# EAGLE design Arduino_PLC (EAGLE 9.6.2)
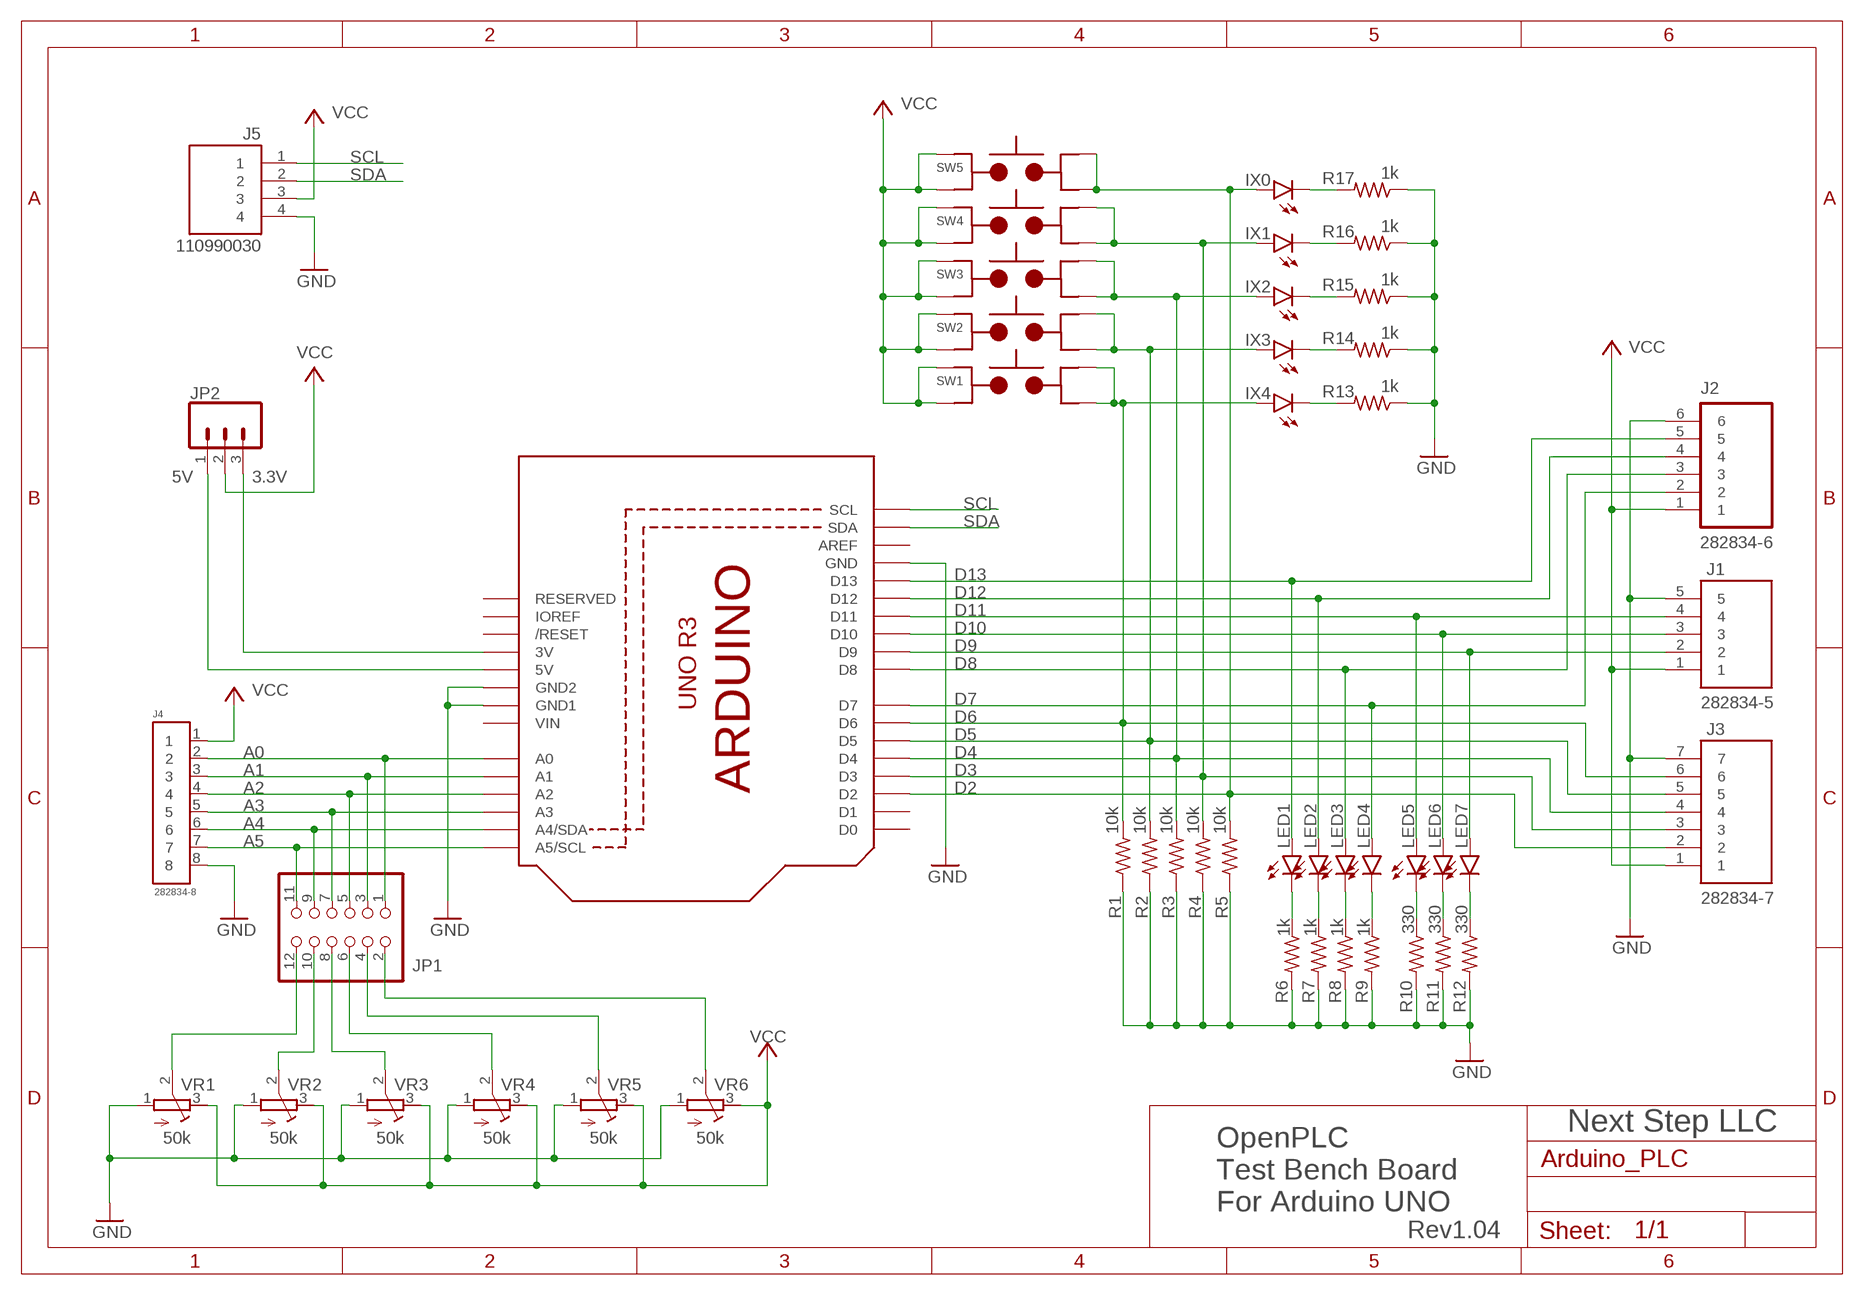
[diagram p0: schematic, sheet 1]

## Parts
IX0  LEDCHIP-LED0603  [CHIP-LED0603]
IX1  LEDCHIP-LED0603  [CHIP-LED0603]
IX2  LEDCHIP-LED0603  [CHIP-LED0603]
IX3  LEDCHIP-LED0603  [CHIP-LED0603]
IX4  LEDCHIP-LED0603  [CHIP-LED0603]
J1  282834-5  [TE_282834-5]
J2  282834-6  [TE_282834-6]
J3  282834-7  [TE_282834-7]
J4  282834-8  [HDRV8W85P254_8X1_2078X650X1000]
J5  110990030  [SEEED_110990030]
JP1  PINHD-2X6  [2X06]
JP2  455-1750-1-ND  CONN_03  [1X03]
LED1  LEDCHIP-LED0603  [CHIP-LED0603]
LED2  LEDCHIP-LED0603  [CHIP-LED0603]
LED3  LEDCHIP-LED0603  [CHIP-LED0603]
LED4  LEDCHIP-LED0603  [CHIP-LED0603]
LED5  LEDCHIP-LED0603  [CHIP-LED0603]
LED6  LEDCHIP-LED0603  [CHIP-LED0603]
LED7  LEDCHIP-LED0603  [CHIP-LED0603]
R1  10k  R-US_R0603  [R0603]
R2  10k  R-US_R0603  [R0603]
R3  10k  R-US_R0603  [R0603]
R4  10k  R-US_R0603  [R0603]
R5  10k  R-US_R0603  [R0603]
R6  1k  R-US_R0603  [R0603]
R7  1k  R-US_R0603  [R0603]
R8  1k  R-US_R0603  [R0603]
R9  1k  R-US_R0603  [R0603]
R10  330  R-US_R0603  [R0603]
R11  330  R-US_R0603  [R0603]
R12  330  R-US_R0603  [R0603]
R13  1k  R-US_R0603  [R0603]
R14  1k  R-US_R0603  [R0603]
R15  1k  R-US_R0603  [R0603]
R16  1k  R-US_R0603  [R0603]
R17  1k  R-US_R0603  [R0603]
SW1  TL3342F160QG/TR  [SW_TL3342F160QG/TR]
SW2  TL3342F160QG/TR  [SW_TL3342F160QG/TR]
SW3  TL3342F160QG/TR  [SW_TL3342F160QG/TR]
SW4  TL3342F160QG/TR  [SW_TL3342F160QG/TR]
SW5  TL3342F160QG/TR  [SW_TL3342F160QG/TR]
U1  ARDUINOR3-DIMENSION  [ARDUINOR3]
VR1  50k  R-TRIMM3339P  [RTRIM3339P]
VR2  50k  R-TRIMM3339P  [RTRIM3339P]
VR3  50k  R-TRIMM3339P  [RTRIM3339P]
VR4  50k  R-TRIMM3339P  [RTRIM3339P]
VR5  50k  R-TRIMM3339P  [RTRIM3339P]
VR6  50k  R-TRIMM3339P  [RTRIM3339P]

## Nets
A0: J4.2 JP1.1 U1.A0
A1: J4.3 JP1.3 U1.A1
A2: J4.4 JP1.5 U1.A2
A3: J4.5 JP1.7 U1.A3
A4: J4.6 JP1.9 U1.A4(A4/SDA)
A5: J4.7 JP1.11 U1.A5(A5/SCL)
D2: IX0.A J3.2 R5.2 SW5.1 SW5.2 U1.D2
D3: IX1.A J3.3 R4.2 SW4.1 SW4.2 U1.D3
D4: IX2.A J3.4 R3.2 SW3.1 SW3.2 U1.D4
D5: IX3.A J3.5 R2.2 SW2.1 SW2.2 U1.D5
D6: IX4.A J3.6 R1.2 SW1.1 SW1.2 U1.D6
D7: J2.2 LED4.A U1.D7
D8: J2.3 LED3.A U1.D8
D9: J1.2 LED7.A U1.D9
D10: J1.3 LED6.A U1.D10
D11: J1.4 LED5.A U1.D11
D12: J2.4 LED2.A U1.D12
D13: J2.5 LED1.A U1.D13
GND: J1.5 J2.6 J3.7 J4.8 J5.4 R1.1 R2.1 R3.1 R4.1 R5.1 R6.2 R7.2 R8.2 R9.2 R10.2 R11.2 R12.2 R13.1 R14.1 R15.1 R16.1 R17.1 U1.GND U1.GND1 U1.GND2 VR1.1(A) VR2.1(A) VR3.1(A) VR4.1(A) VR5.1(A) VR6.1(A)
N$1: LED1.C R6.1
N$2: LED2.C R7.1
N$3: LED3.C R8.1
N$4: LED4.C R9.1
N$5: LED5.C R10.1
N$6: LED6.C R11.1
N$7: LED7.C R12.1
N$8: JP1.12 VR1.2(S)
N$9: JP1.10 VR2.2(S)
N$10: JP1.8 VR3.2(S)
N$11: JP1.6 VR4.2(S)
N$12: JP1.4 VR5.2(S)
N$13: JP1.2 VR6.2(S)
N$14: JP2.3 U1.3V
N$16: JP2.1 U1.5V
N$17: IX0.C R17.2
N$18: IX1.C R16.2
N$19: IX2.C R15.2
N$20: IX3.C R14.2
N$21: IX4.C R13.2
SCL: J5.1 U1.SCL
SDA: J5.2 U1.SDA
VCC: J1.1 J2.1 J3.1 J4.1 J5.3 JP2.2 SW1.3 SW1.4 SW2.3 SW2.4 SW3.3 SW3.4 SW4.3 SW4.4 SW5.3 SW5.4 VR1.3(E) VR2.3(E) VR3.3(E) VR4.3(E) VR5.3(E) VR6.3(E)
Unconnected: U1.AREF U1.D0 U1.D1 U1.IOREF U1.RESERVED U1.RESET(/RESET)

## Notes on the sheet
- 5V | 3.3V
- Next Step LLC
- OpenPLC
  Test Bench Board
  For Arduino UNO
- Rev1.04

## Power pins joined to a net without a drawn wire
VIN: U1.VIN

## Library data of the parts
IX0 IX1-IX4 LED1-LED7 = led:LED: LED OSRAM: - CHIPLED LG R971, LG N971, LY N971, LG Q971, LY Q971, LO R971, LY R971 LH N974, LH R974 LS Q976, LO Q976, LY Q976 LO Q996 - Hyper CHIPLED LW Q18S LB Q993, LB Q99A, LB R99A - SideLED LS A670, LO A670, LY A670, LG A670, LP A670 LB A673, LV A673, LT A673, LW A673 LH A674 LY A675 LS A676, LA A676, LO A676, LY A676, LW A676 LS A679, LY A679, LG A679 - Hyper Micro SIDELED® LS Y876, LA Y876, LO Y876, LY Y876 LT Y87S - SmartLED LW L88C, LW L88S LB L89C, LB L89S, LG L890 LS L89K, LO L89K, LY L89K LS L896, LA L896, LO L896, LY L896 - TOPLED LS T670, LO T670, LY T670, LG T670, LP T670 LSG T670, LSP T670, LSY T670, LOP T670, LYG T670 LG T671, LOG T671, LSG T671 LB T673, LV T673, LT T673, LW T673 LH T674 LS T676, LA T676, LO T676, LY T676, LB T676, LH T676, LSB T676, LW T676 LB T67C, LV T67C, LT T67C, LS T67K, LO T67K, LY T67K, LW E67C LS E67B, LA E67B, LO E67B, LY E67B, LB E67C, LV E67C, LT E67C LW T67C LS T679, LY T679, LG T679 LS T770, LO T770, LY T770, LG T770, LP T770 LB T773, LV T773, LT T773, LW T773 LH T774 LS E675, LA E675, LY E675, LS T675 LS T776, LA T776, LO T776, LY T776, LB T776 LHGB T686 LT T68C, LB T68C - Hyper Mini TOPLED® LB M676 - Mini TOPLED Santana® LG M470 LS M47K, LO M47K, LY M47K Source: http://www.osram.convergy.de LUXEON: - LUMILED® LXK2-PW12-R00, LXK2-PW12-S00, LXK2-PW14-U00, LXK2-PW14-V00 LXK2-PM12-R00, LXK2-PM12-S00, LXK2-PM14-U00 LXK2-PE12-Q00, LXK2-PE12-R00, LXK2-PE12-S00, LXK2-PE14-T00, LXK2-PE14-U00 LXK2-PB12-K00, LXK2-PB12-L00, LXK2-PB12-M00, LXK2-PB14-N00, LXK2-PB14-P00, LXK2-PB14-Q00 LXK2-PR12-L00, LXK2-PR12-M00, LXK2-PR14-Q00, LXK2-PR14-R00 LXK2-PD12-Q00, LXK2-PD12-R00, LXK2-PD12-S00 LXK2-PH12-R00, LXK2-PH12-S00 LXK2-PL12-P00, LXK2-PL12-Q00, LXK2-PL12-R00 Source: www.luxeon.com KINGBRIGHT: KA-3528ASYC Source: www.kingbright.com
J1 = 282834-5:282834-5: Check availability <https://pricing.snapeda.com/parts/282834-5/TE%20Connectivity/view-part?ref=eda>; AVAILABILITY: In Stock; COMMENT: 282834-5; DESCRIPTION: Buchanan; Conn; Term Blk; PCB; 5; 2.54mm; Front; 30-16 AWG; Green; 10 A; 150 V; MF: TE Connectivity; MP: 282834-5; PACKAGE: None; PRICE: None; PURCHASE-URL: https://pricing.snapeda.com/search/part/282834-5/?ref=eda
J2 = 282834-6:282834-6: TERM BLOCK 6POS SIDE ENT 2.54MM Check availability <https://pricing.snapeda.com/parts/282834-6/TE%20Connectivity/view-part?ref=eda>; AVAILABILITY: In Stock; COMMENT: 282834-6; DESCRIPTION: Wire-To-Board Terminal Block, 6, 150 V, 10 A, 30 Awg, 16 Awg, 1.4 Mm; EU_ROHS_COMPLIANCE: Compliant with Exemptions; MF: TE Connectivity; MP: 282834-6; PACKAGE: None; PRICE: None; PURCHASE-URL: https://pricing.snapeda.com/search/part/282834-6/?ref=eda
J3 = 282834-7:282834-7: Check availability <https://pricing.snapeda.com/parts/282834-7/TE%20Connectivity/view-part?ref=eda>; AVAILABILITY: In Stock; COMMENT: 282834-7; DESCRIPTION: TERMI-BLOK PCB MOUNT, 90 7P.; EU_ROHS_COMPLIANCE: Compliant with Exemptions; MF: TE Connectivity; MP: 282834-7; PACKAGE: None; PRICE: None; PURCHASE-URL: https://pricing.snapeda.com/search/part/282834-7/?ref=eda
J4 = 282834-8:282834-8: Screw terminal 1.4 mm² Number of pins 8 282834-8 TE Connectivity Green 1 pc(s) Check availability <https://pricing.snapeda.com/parts/282834-8/TE%20Connectivity/view-part?ref=eda>; AVAILABILITY: In Stock; COMMENT: 282834-8; DESCRIPTION: Buchanan; Conn; Term Blk; PCB; 8; 2.54mm; Front; 30-16 AWG; Green; 10 A; 150 V; EU_ROHS_COMPLIANCE: Compliant with Exemptions; MF: TE Connectivity; MP: 282834-8; PACKAGE: None; PRICE: None; PURCHASE-URL: https://pricing.snapeda.com/search/part/282834-8/?ref=eda
J5 = 110990030:110990030: Check prices <https://pricing.snapeda.com/parts/110990030/Seeed%20Technology%20Co.%2C%20Ltd/view-part?ref=eda>; AVAILABILITY: Good; DESCRIPTION: GROVE 2MM 4PIN VERT CONN 10PCS; MF: Seeed Technology Co., Ltd; MP: 110990030; PACKAGE: None; PRICE: None; PURCHASE-URL: https://pricing.snapeda.com/search/part/110990030/?ref=eda
JP1 = pinhead:PINHD-2X6: PIN HEADER
JP2 = SparkFun-Connectors:CONN_03: Multi connection point. Often used as Generic Header-pin footprint for 0.1 inch spaced/style header connections On any of the 0.1 inch spaced packages, you can populate with these: Break Away Headers - Straight <https://www.sparkfun.com/products/116> (PRT-00116) Break Away Male Headers - Right Angle <https://www.sparkfun.com/products/553> (PRT-00553) Female Headers <https://www.sparkfun.com/products/115> (PRT-00115) Break Away Headers - Machine Pin <https://www.sparkfun.com/products/117> (PRT-00117) Break Away Female Headers - Swiss Machine Pin <https://www.sparkfun.com/products/743> (PRT-00743) Stackable Header - 3 Pin (Female, 0.1") <https://www.sparkfun.com/products/13875> (PRT-13875) For SCREWTERMINALS and SPRING TERMINALS visit here: Screw Terimnals on SparkFun.com <https://www.sparkfun.com/search/results?term=Screw+Terminals> (5mm/3.5mm/2.54mm spacing) This device is also useful as a general connection point to wire up your design to another part of your project. Our various solder wires solder well into these plated through hole pads. Hook-Up Wire - Assortment (Stranded, 22 AWG) <https://www.sparkfun.com/products/11375> (PRT-11375) Hook-Up Wire - Assortment (Solid Core, 22 AWG) <https://www.sparkfun.com/products/11367> (PRT-11367) View the entire wire category on our website here <https://www.sparkfun.com/categories/141> Special notes: Molex polarized connector foot print use with SKU : PRT-08232 with associated crimp pins and housings.; PROD_ID: XXX-00000
R1-R17 = rcl:R-US_: RESISTOR, American symbol; SPICEPREFIX: R
SW1-SW5 = TL3342F160QG_TR:TL3342F160QG/TR: TL3342 Series SPST 1.6 N Round Button Gull Wing Surface Mount Tactile Switch Check availability <https://pricing.snapeda.com/parts/TL3342F160QG/TR/E-Switch/view-part?ref=eda>; AVAILABILITY: In Stock; DESCRIPTION: Tactile Switch SPST-NO Top Actuated Surface Mount; MF: E-Switch; MP: TL3342F160QG/TR; PACKAGE: None; PRICE: None; PURCHASE-URL: https://pricing.snapeda.com/search/part/TL3342F160QG/TR/?ref=eda
U1 = adafruit:ARDUINOR3: This is a new object for the new Arduino R3 - with extra pins that you may want to use (such as IOref, and duplicated A4/A5
VR1-VR6 = rcl:R-TRIMM: Trimm resistor; SPICEMODEL: X; SPICEPREFIXL: POT

## Board
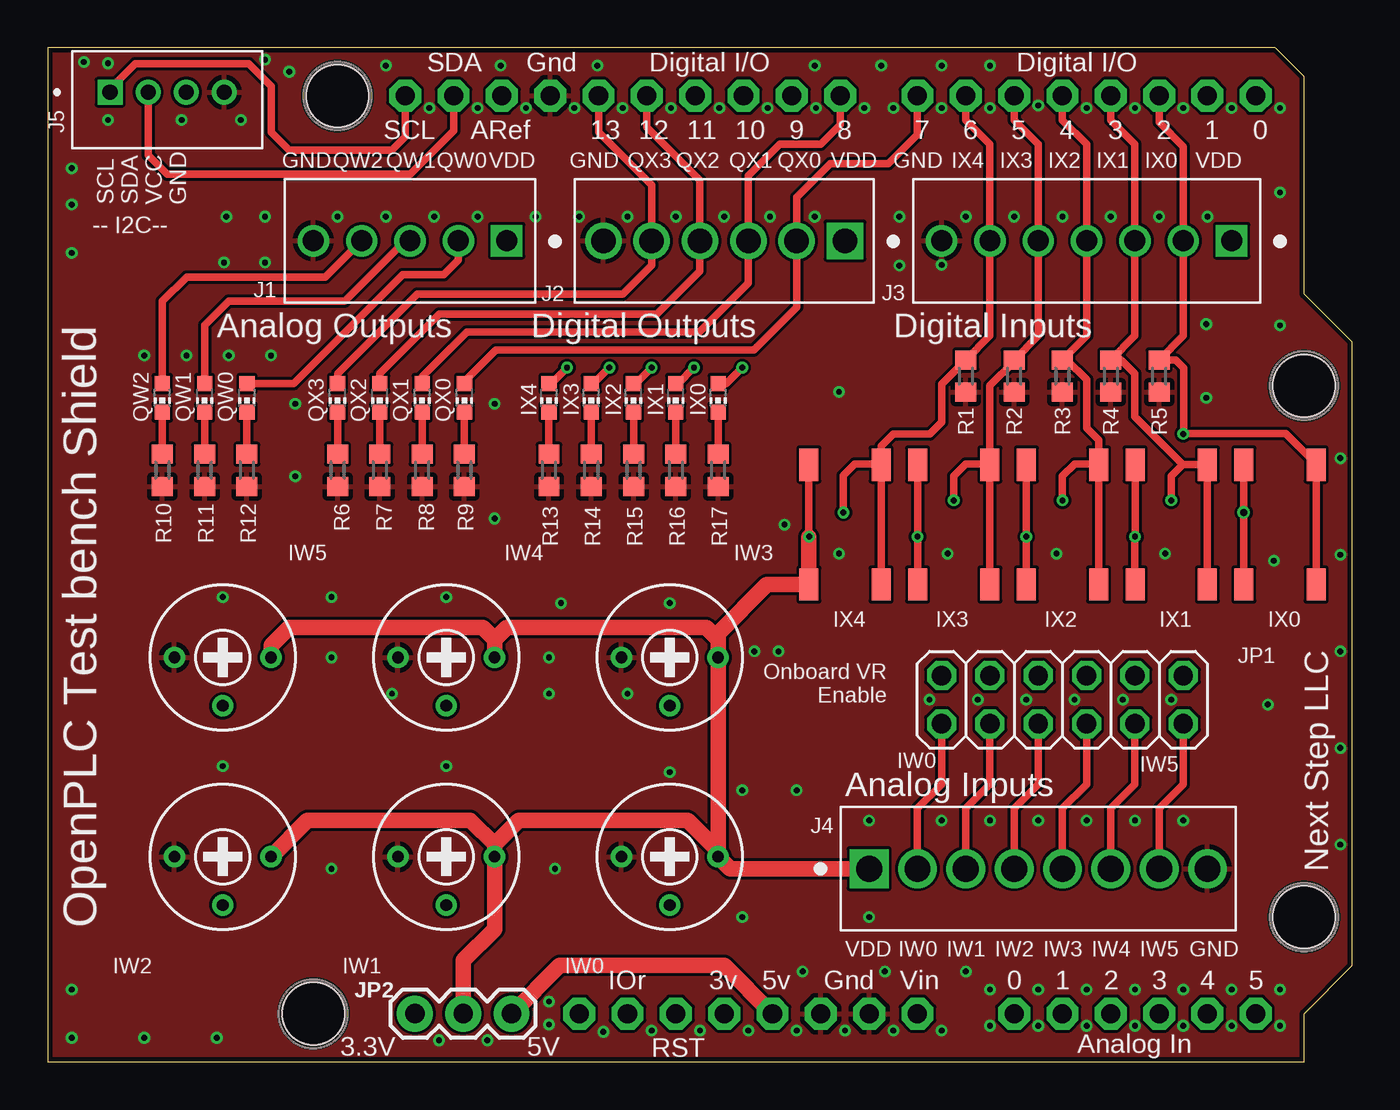
[diagram p1: board, top side]
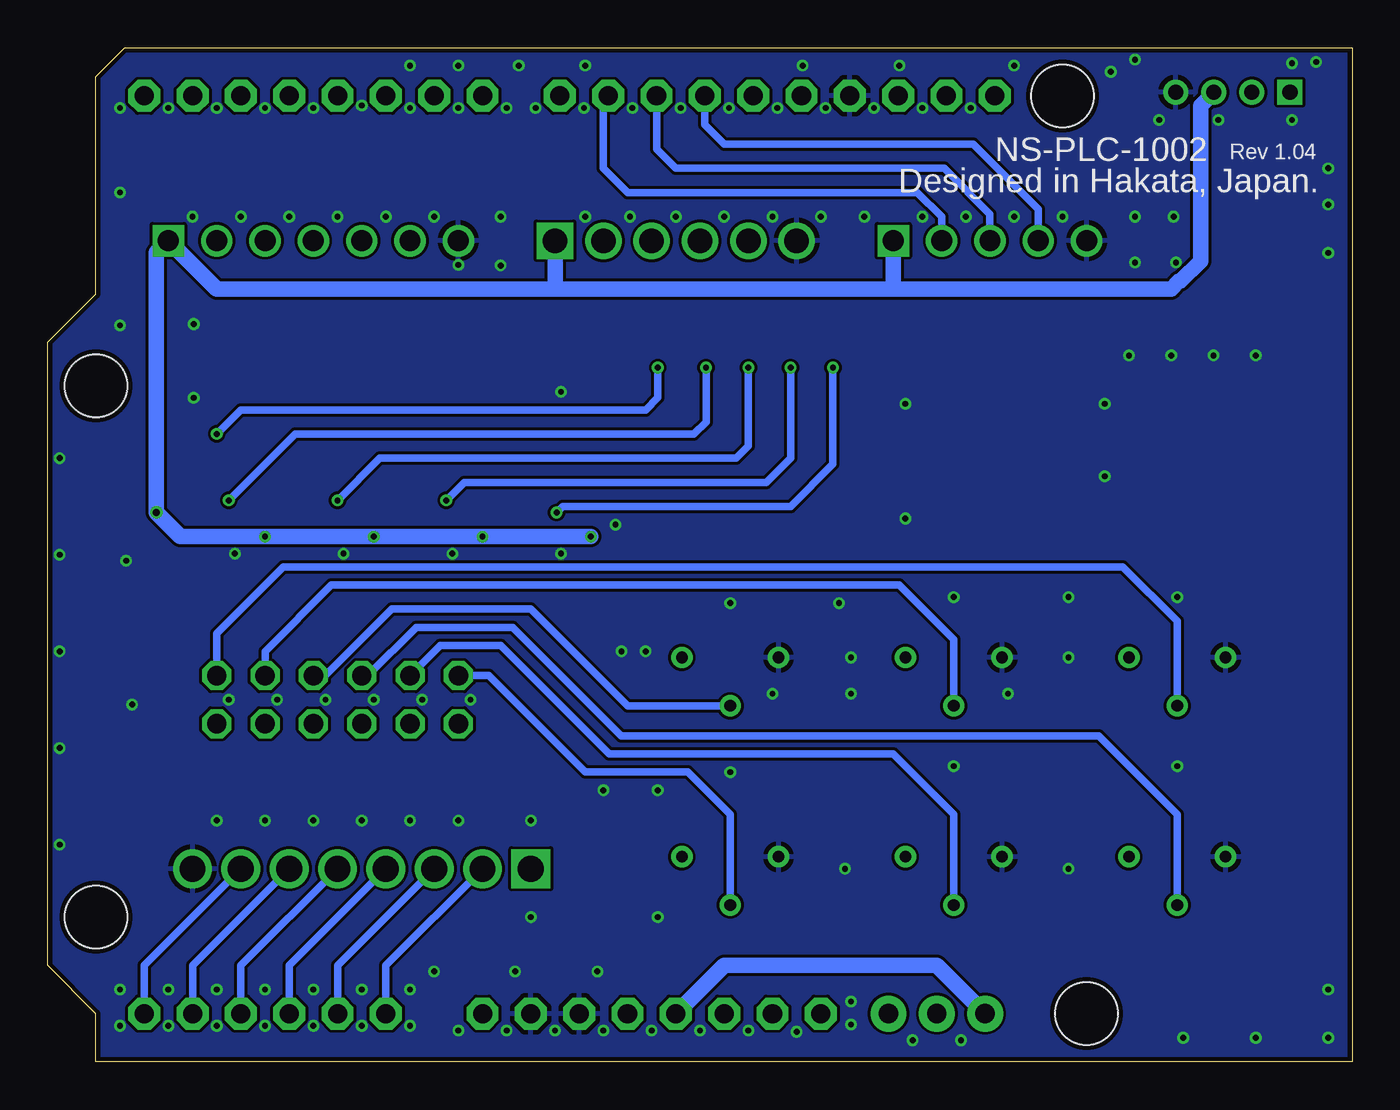
[diagram p2: board, bottom side, seen from below]

Size 68.58 x 53.34 mm. Coordinates in mm from the lower left corner, seen from the top.
Copper layers (1*16): Top 0.035mm / dielectric 1.5mm / Bottom 0.035mm
Design rules "SeeedStudio_2layer_DRU_no_angle_20140221": minimum track width 6mil, minimum drill 12mil, track to track 6mil, track to pad 6mil, pad to pad 6mil, via to via 6mil, smd to smd 0mil, copper to edge 10mil, drill to drill 10mil, minimum pad ring 10mil, minimum via ring 6mil, stop-mask expansion 2mil, vias tented up to drill 100mil, thermal gap 10mil
Holes 3.3 mm at 15.24,50.8 13.97,2.54 66.04,7.62 66.04,35.56

### Footprints (pad centres in the part's own frame; a part is rotated, then mirrored left to right if it is on the bottom)
CHIP-LED0603 = smd 0.8 x 0.8: A 0,-0.75; C 0,0.75
TE_282834-5 = drill 1.1 square: 1 -5.08,0 | drill 1.1: 2 -2.54,0; 3 0,0; 4 2.54,0; 5 5.08,0
TE_282834-6 = drill 1.28 pad 1.92 square: 1 -6.35,0 | drill 1.28 pad 1.92: 2 -3.81,0; 3 -1.27,0; 4 1.27,0; 5 3.81,0; 6 6.35,0
TE_282834-7 = drill 1.1 square: 1 -7.62,0 | drill 1.1: 2 -5.08,0; 3 -2.54,0; 4 0,0; 5 2.54,0; 6 5.08,0; 7 7.62,0
HDRV8W85P254_8X1_2078X650X1000 = drill 1.36 square: 1 0,0 | drill 1.36: 2 2.54,0; 3 5.08,0; 4 7.62,0; 5 10.16,0; 6 12.7,0; 7 15.24,0; 8 17.78,0
SEEED_110990030 = drill 0.8 square: 1 -3,0 | drill 0.8: 2 -1,0; 3 1,0; 4 3,0
2X06 = drill 1.016 octagon: 1 -6.35,-1.27; 2 -6.35,1.27; 3 -3.81,-1.27; 4 -3.81,1.27; 5 -1.27,-1.27; 6 -1.27,1.27; 7 1.27,-1.27; 8 1.27,1.27; 9 3.81,-1.27; 10 3.81,1.27; 11 6.35,-1.27; 12 6.35,1.27
1X03 = drill 1.016 pad 1.88: 1 0,0; 2 2.54,0; 3 5.08,0
R0603 = smd 1 x 1.1: 1 -0.85,0; 2 0.85,0
SW_TL3342F160QG/TR = smd 1.7 x 1: 1 -3.15,-1.9; 2 3.15,-1.9; 3 -3.15,1.9; 4 3.15,1.9
ARDUINOR3 = drill 1 pad 1.676 octagon: 3V 35.56,2.54; 5V 38.1,2.54; A0 50.8,2.54; A1 53.34,2.54; A2 55.88,2.54; A3 58.42,2.54; A4 60.96,2.54; A5 63.5,2.54; AREF 23.876,50.8; D0 63.5,50.8; D1 60.96,50.8; D2 58.42,50.8; D3 55.88,50.8; D4 53.34,50.8; D5 50.8,50.8; D6 48.26,50.8; D7 45.72,50.8; D8 41.656,50.8; D9 39.116,50.8; D10 36.576,50.8; D11 34.036,50.8; D12 31.496,50.8; D13 28.956,50.8; GND 26.416,50.8; GND1 43.18,2.54; GND2 40.64,2.54; IOREF 30.48,2.54; RESERVED 27.94,2.54; RESET 33.02,2.54; SCL 18.796,50.8; SDA 21.336,50.8; VIN 45.72,2.54
RTRIM3339P = drill 0.61: 1 -2.54,0; 2 0,-2.54; 3 2.54,0

### Placement (x,y rotation side)
IX0  35.24,34.92 180 top
IX1  33.02,34.92 180 top
IX2  30.8,34.92 180 top
IX3  28.57,34.92 180 top
IX4  26.35,34.92 180 top
J1  19.05,43.18 180 top
J2  35.56,43.18 180 top
J3  54.61,43.18 180 top
J4  43.18,10.16 0 top
J5  6.29,50.99 0 top
JP1  53.34,19.05 0 top
JP2  24.38,2.54 180 top
LED1  15.24,34.92 180 top
LED2  17.46,34.92 180 top
LED3  19.68,34.92 180 top
LED4  21.91,34.92 180 top
LED5  6.03,34.92 180 top
LED6  8.26,34.92 180 top
LED7  10.48,34.92 180 top
R1  48.26,36.07 90 top
R2  50.8,36.07 90 top
R3  53.34,36.07 90 top
R4  55.88,36.07 90 top
R5  58.42,36.07 90 top
R6  15.24,31.11 270 top
R7  17.46,31.11 270 top
R8  19.68,31.11 270 top
R9  21.91,31.11 270 top
R10  6.03,31.11 270 top
R11  8.26,31.11 270 top
R12  10.48,31.11 270 top
R13  26.35,31.11 90 top
R14  28.57,31.11 90 top
R15  30.8,31.11 90 top
R16  33.02,31.11 90 top
R17  35.24,31.11 90 top
SW1  41.91,28.26 90 top
SW2  47.62,28.26 90 top
SW3  53.34,28.26 90 top
SW4  59.05,28.26 90 top
SW5  64.77,28.26 90 top
U1  0,0 0 top
VR1  9.21,21.27 0 top
VR2  20.95,21.27 0 top
VR3  32.7,21.27 0 top
VR4  9.21,10.79 0 top
VR5  20.95,10.79 0 top
VR6  32.7,10.79 0 top

### Tracks (layer width: path | path; a pad name or v marks a point on that pad's centre or on a via)
A0
  Top 0.406: JP1.1 46.99,14.61 45.72,13.34 J4.2
  Bottom 0.406: J4.2 50.8,5.08 U1.A0
A1
  Top 0.406: JP1.3 49.53,14.61 48.26,13.34 J4.3
  Bottom 0.406: J4.3 53.34,5.08 U1.A1
A2
  Top 0.406: JP1.5 52.07,14.61 50.8,13.34 J4.4
  Bottom 0.406: J4.4 55.88,5.08 U1.A2
A3
  Top 0.406: JP1.7 54.61,14.61 53.34,13.34 J4.5
  Bottom 0.406: J4.5 58.42,5.08 U1.A3
A4
  Top 0.406: JP1.9 57.15,14.61 55.88,13.34 J4.6
  Bottom 0.406: J4.6 60.96,5.08 U1.A4
A5
  Top 0.406: JP1.11 59.69,14.61 58.42,13.34 J4.7
  Bottom 0.406: J4.7 63.5,5.08 U1.A5
D2  (via drill 0.3)
  Top 0.406: U1.D2 58.42,49.4 59.69,48.13 J3.2 59.69,38.19 R5.2 59.28,36.92 59.71,36.49 59.71,33.04 | v59.69,33.02 59.71,33.04 | v36.51,36.51 35.67,35.67 IX0.A | SW5.1 SW5.2 66.67,31.44 65.07,33.04 59.71,33.04
  Bottom 0.406: v36.51,36.51 36.51,34.92 37.15,34.29 58.42,34.29 v59.69,33.02
D3  (via drill 0.3)
  Top 0.406: U1.D3 55.88,49.53 57.15,48.26 J3.3 57.15,38.19 R4.2 56.43,36.92 57.15,36.2 57.15,33.94 59.67,31.42 | v33.97,36.51 33.13,35.67 IX1.A | SW4.1 SW4.2 59.69,31.41 59.67,31.42 | v59.05,29.53 59.05,30.8 59.67,31.42
  Bottom 0.406: v59.05,29.53 55.56,33.02 34.61,33.02 33.97,33.66 v33.97,36.51
D4  (via drill 0.3)
  Top 0.406: U1.D4 53.34,49.53 54.61,48.26 J3.4 54.61,38.19 R3.2 53.57,36.92 54.61,35.88 54.61,33.34 55.24,32.7 SW3.2 | v31.75,36.51 30.91,35.67 IX2.A | SW3.2 SW3.1 | v53.34,29.53 53.34,30.8 53.98,31.43 55.22,31.43 SW3.2
  Bottom 0.406: v53.34,29.53 51.12,31.75 32.38,31.75 31.75,32.38 v31.75,36.51
D5  (via drill 0.3)
  Top 0.406: U1.D5 50.8,49.53 52.07,48.26 J3.5 52.07,38.19 R2.2 50.8,36.83 49.53,35.56 SW2.2 | v29.53,36.51 28.69,35.67 IX3.A | SW2.2 SW2.1 | v47.62,29.53 47.62,30.8 48.26,31.43 49.5,31.43 SW2.2
  Bottom 0.406: v47.62,29.53 46.67,30.48 30.8,30.48 29.53,31.75 v29.53,36.51
D6  (via drill 0.3)
  Top 0.406: U1.D6 48.26,49.53 49.53,48.26 J3.6 49.53,38.19 R1.2 46.99,35.65 46.99,33.66 46.35,33.02 44.45,33.02 43.81,32.38 SW1.2 | v27.3,36.51 26.47,35.67 IX4.A | SW1.2 SW1.1 | v41.82,28.89 41.82,30.84 42.42,31.43 43.78,31.43 SW1.2
  Bottom 0.406: v41.82,28.89 41.51,29.21 29.53,29.21 27.3,31.43 v27.3,36.51
D7
  Top 0.406: U1.D7 45.72,48.77 44.2,47.24 41.15,47.24 39.37,45.47 J2.2 39.37,39.69 37.12,37.44 23.56,37.44 21.91,35.79 LED4.A
D8
  Top 0.406: U1.D8 41.66,49.28 40.64,48.26 38.48,48.26 36.83,46.61 J2.3 36.83,40.96 34.25,38.38 22.04,38.38 19.68,36.03 LED3.A
D9
  Top 0.406: LED7.A 12.94,35.67 18.67,41.4 20.83,41.4 21.59,42.16 J1.2
  Bottom 0.406: J1.2 21.59,44.45 22.86,45.72 38.1,45.72 39.37,46.99 39.37,50.55 U1.D9
D10
  Top 0.406: LED6.A 8.26,38.73 9.53,40.01 15.62,40.01 18.8,43.18 J1.3
  Bottom 0.406: J1.3 19.05,44.58 21.46,46.99 35.56,46.99 36.58,48.01 U1.D10
D11
  Top 0.406: LED5.A 6.03,40.01 7.3,41.27 14.61,41.27 J1.4
  Bottom 0.406: J1.4 16.51,44.83 19.94,48.26 33.02,48.26 34.04,49.28 U1.D11
D12
  Top 0.406: U1.D12 31.5,49.15 34.29,46.35 J2.4 34.29,41.59 32.02,39.32 20.59,39.32 17.46,36.2 LED2.A
D13
  Top 0.406: U1.D13 28.96,48.9 31.75,46.1 J2.5 31.75,41.91 30.23,40.39 19.43,40.39 15.24,36.2 LED1.A
GND  (via drill 0.3)
  other vias: 12.7,52.07 11.43,52.7 3.17,52.51 1.91,52.58 1.27,46.99 1.27,45.09 1.27,42.55 1.27,3.81 1.27,1.27 5.08,1.27 8.89,1.27 20.57,1.14 23.11,1.14 26.35,1.97 29.21,1.59 31.75,1.65 34.29,1.65 36.83,1.65 39.37,1.65 41.91,1.65 44.45,1.65 46.99,1.65 39.69,4.76 44.01,4.76 48.26,4.76 49.53,3.81 49.53,1.91 52.07,3.81 52.07,1.91 54.61,1.91 54.61,3.81 57.15,1.91 57.15,3.81 59.69,3.81 59.69,1.91 62.23,3.81 62.23,1.91 64.77,3.81 64.77,1.91 39.37,14.29 43.18,12.7 46.99,12.7 49.53,12.7 52.07,12.7 54.61,12.7 57.15,12.7 59.69,12.7 67.94,11.43 67.94,16.51 67.94,21.59 67.94,26.67 67.94,31.75 64.77,38.73 64.77,45.72 64.77,50.16 62.23,50.16 59.69,50.16 57.15,50.16 54.61,50.16 52.07,50.29 49.53,50.16 46.99,50.16 44.45,50.16 42.93,50.16 40.39,50.16 37.85,50.16 35.31,50.16 32.77,50.16 30.23,50.16 27.69,50.16 25.15,50.16 22.61,50.16 20.07,50.16 9.4,44.45 11.43,44.45 15.24,44.45 17.78,44.45 20.32,44.45 22.61,44.45 25.65,44.45 27.94,44.45 30.48,44.45 33.02,44.45 35.56,44.45 37.97,44.45 44.77,44.45 48.26,44.45 50.8,44.45 53.34,44.45 55.88,44.45 58.42,44.45 60.96,44.45 46.99,41.91 11.43,42.04 9.27,42.04 64.14,18.8 38.42,21.59 30.48,19.37 18.1,19.37 26.35,3.17 44.77,41.88 40.32,44.45 64.45,26.35 58.74,26.73 53.02,26.73 47.31,26.73 41.59,26.73 41.59,35.24 23.5,28.57 13.02,30.8 10.16,49.53 7.05,49.53 3.17,49.53 49.53,52.39 46.99,52.39 43.81,52.39 40.32,52.39 28.89,52.39 23.81,52.39 17.78,52.39 36.51,7.62 36.51,14.29 26.35,19.37 37.15,21.59 5.08,37.15 7.3,37.15 9.53,37.15 11.75,37.15 13.02,34.61 23.5,34.61 38.73,28.26 9.21,24.45 14.92,24.45 14.92,21.27 20.95,24.45 26.99,24.13 26.35,21.27 32.7,24.13 9.21,15.56 20.95,15.56 32.7,15.24 14.92,10.16 26.67,10.16 43.18,7.62 60.9,38.8 60.9,34.92 46.35,19.05 48.9,19.05 51.44,19.05 53.98,19.05 56.52,19.05 59.05,19.05
  pour Top: 0,53.34 64.64,53.34 66.04,51.94 66.04,40.26 68.45,37.85 68.58,37.85 68.58,5.08 66.17,2.67 66.17,2.41 66.04,2.29 66.04,0 0,0
  pour Bottom: 0,53.34 64.77,53.34 66.04,52.07 66.04,40.64 68.58,38.1 68.58,5.08 66.04,2.54 66.04,0 0,0
N$1
  Top 0.406: R6.1 LED1.C
N$2
  Top 0.406: LED2.C R7.1
N$3
  Top 0.406: LED3.C R8.1
N$4
  Top 0.406: LED4.C R9.1
N$5
  Top 0.406: LED5.C R10.1
N$6
  Top 0.406: LED6.C R11.1
N$7
  Top 0.406: LED7.C R12.1
N$8
  Bottom 0.406: JP1.12 59.69,22.54 56.2,26.04 12.06,26.04 9.21,23.18 VR1.2
N$9
  Bottom 0.406: JP1.10 57.15,21.59 53.66,25.08 23.81,25.08 20.95,22.23 VR2.2
N$10
  Bottom 0.406: JP1.8 53.98,20.32 50.48,23.81 43.18,23.81 38.1,18.73 VR3.2
N$11
  Bottom 0.406: JP1.6 51.75,20.32 49.21,22.86 44.13,22.86 38.42,17.14 13.34,17.14 9.21,13.02 VR4.2
N$12
  Bottom 0.406: JP1.4 47.94,21.91 44.77,21.91 39.05,16.19 24.13,16.19 20.95,13.02 VR5.2
N$13
  Bottom 0.406: JP1.2 45.4,20.32 40.32,15.24 34.92,15.24 32.7,13.02 VR6.2
N$14
  Bottom 0.813: U1.3V 33.02,5.08 21.84,5.08 JP2.3
N$16
  Top 0.813: U1.5V 35.56,5.08 26.92,5.08 JP2.1
N$17
  Top 0.406: IX0.C R17.2
N$18
  Top 0.406: IX1.C R16.2
N$19
  Top 0.406: IX2.C R15.2
N$20
  Top 0.406: IX3.C R14.2
N$21
  Top 0.406: IX4.C R13.2
SCL
  Top 0.406: J5.1 3.29,51.17 4.61,52.49 10.57,52.49 11.75,51.31 11.75,48.9 12.7,47.94 18.1,47.94 18.8,48.64 U1.SCL
SDA
  Top 0.406: J5.2 5.29,47.69 6.3,46.67 19.05,46.67 21.34,48.96 U1.SDA
VCC  (via drill 0.3, 0.35)
  Top 0.406: 40.01,27.6 v40.03,27.62 40.01,27.64 SW1.4 | SW2.3 v45.73,27.62 | v45.73,27.62 v45.72,27.62 | SW2.4 v45.73,27.62 | SW3.3 v51.44,27.62 | v51.44,27.62 | SW3.4 v51.44,27.62 | SW4.3 v57.15,27.62 v57.16,27.63 SW4.4 | SW5.4 v62.87,28.9 | v62.87,28.9 v62.87,28.89 | SW5.3 v62.87,28.9
  Top 0.813: 40.01,27.6 SW1.3 37.81,25.11 35.24,22.54 35.24,22.23 | VR6.3 35.88,10.16 J4.1 | VR4.3 13.65,12.7 22.23,12.7 23.5,11.43 | 23.5,11.43 VR5.3 23.5,6.99 21.84,5.33 JP2.2 | 23.5,11.43 24.77,12.7 33.66,12.7 35.24,11.11 VR6.3 | 35.24,22.23 VR3.3 VR6.3 | VR1.3 11.75,21.91 12.7,22.86 22.86,22.86 23.5,22.23 | VR2.3 23.5,22.23 | 23.5,22.23 24.13,22.86 34.61,22.86 35.24,22.23
  Bottom 0.813: J2.1 41.91,40.64 | 41.91,40.64 59.69,40.64 J3.1 62.87,42.55 v62.87,28.89 61.59,27.62 v57.15,27.62 v51.44,27.62 v45.72,27.62 v40.03,27.62 | J5.3 7.99,50.29 7.99,42.1 9.04,41.05 9.12,41.05 9.53,40.64 24.13,40.64 | 24.13,40.64 41.91,40.64 | J1.1 24.13,40.64

### Text on the board
tPlace: GND | QW2 | QW1 | QW0 | VDD | GND | QX3 | QX2 | QX1 | QX0 | VDD | GND | IX4 | IX3 | IX2 | IX1 | IX0 | VDD | SCL | SDA | VCC | GND | -- I2C-- | Analog Outputs | Digital Outputs | Digital Inputs | QW2 | QW1 | QW0 | QX3 | QX2 | QX1 | QX0 | IW5 | IW4 | IW3 | IX4 | IX3 | IX2 | IX1 | IX0 | Onboard VR / Enable | IW0 | IW5 | Analog Inputs | Next Step LLC | OpenPLC Test bench Shield | VDD | IW0 | IW1 | IW2 | IW3 | IW4 | IW5 | GND | IW2 | IW1 | IW0 | 3.3V | 5V
bPlace: NS-PLC-1002 | Designed in Hakata, Japan. | Rev 1.04